# EAGLE design board_v1 (EAGLE 8.7.0)
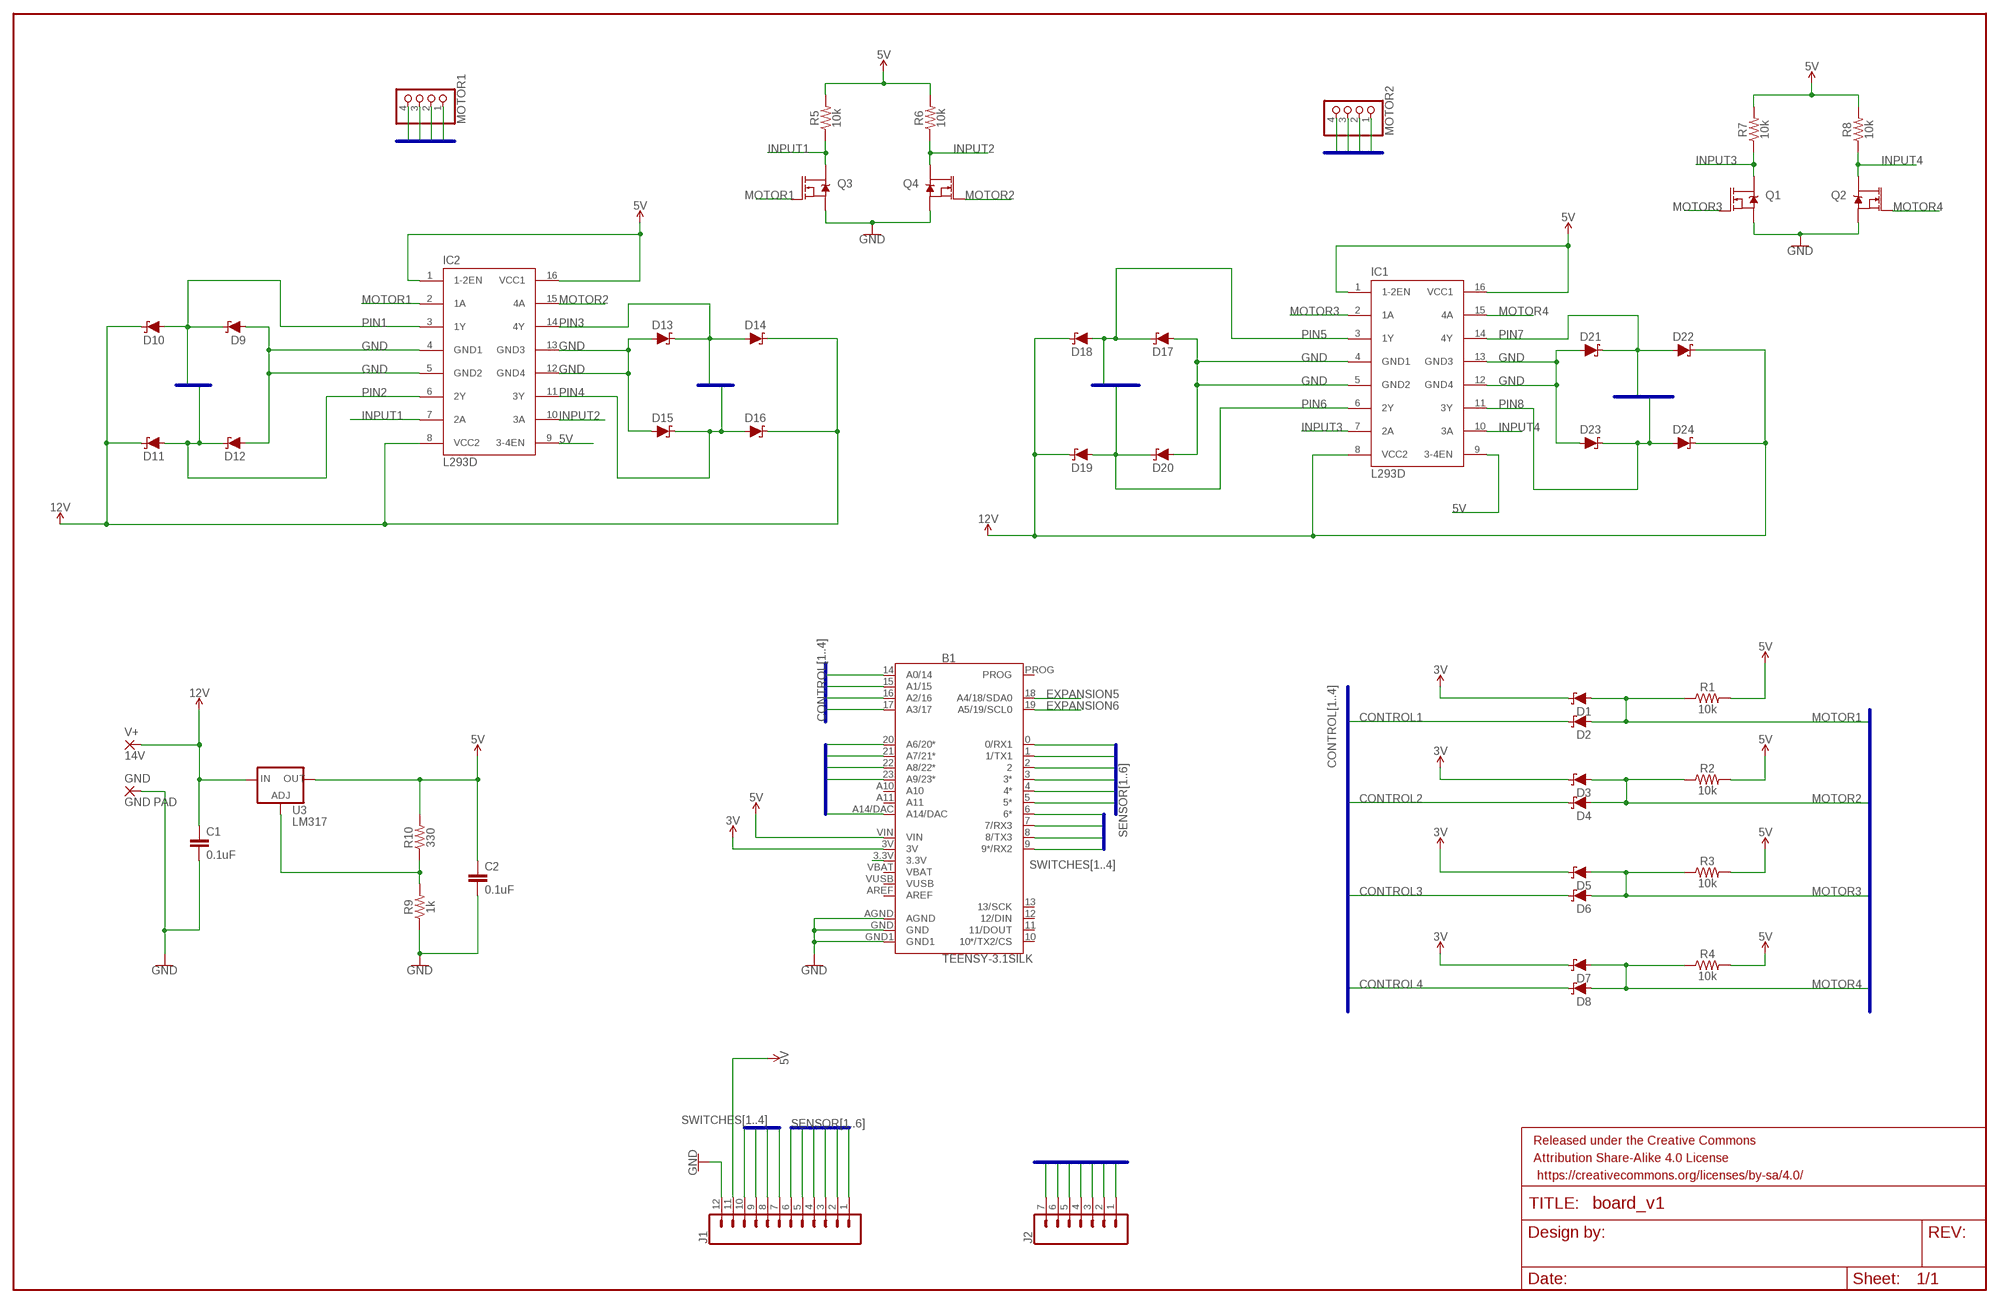
[diagram p0: schematic, sheet 1]

## Parts
B1  TEENSY-3.1SILK  [TEENSY-3.1]
C1  0.1uF  0.1UF-0603-25V-5%  [0603]
C2  0.1uF  0.1UF-0603-25V-5%  [0603]
D1  DIODE-SCHOTTKY-PMEG4005EJ  [SOD-323]
D2  DIODE-SCHOTTKY-PMEG4005EJ  [SOD-323]
D3  DIODE-SCHOTTKY-PMEG4005EJ  [SOD-323]
D4  DIODE-SCHOTTKY-PMEG4005EJ  [SOD-323]
D5  DIODE-SCHOTTKY-PMEG4005EJ  [SOD-323]
D6  DIODE-SCHOTTKY-PMEG4005EJ  [SOD-323]
D7  DIODE-SCHOTTKY-PMEG4005EJ  [SOD-323]
D8  DIODE-SCHOTTKY-PMEG4005EJ  [SOD-323]
D9  DIODE-SCHOTTKY-PMEG4005EJ  [SOD-323]
D10  DIODE-SCHOTTKY-PMEG4005EJ  [SOD-323]
D11  DIODE-SCHOTTKY-PMEG4005EJ  [SOD-323]
D12  DIODE-SCHOTTKY-PMEG4005EJ  [SOD-323]
D13  DIODE-SCHOTTKY-PMEG4005EJ  [SOD-323]
D14  DIODE-SCHOTTKY-PMEG4005EJ  [SOD-323]
D15  DIODE-SCHOTTKY-PMEG4005EJ  [SOD-323]
D16  DIODE-SCHOTTKY-PMEG4005EJ  [SOD-323]
D17  DIODE-SCHOTTKY-PMEG4005EJ  [SOD-323]
D18  DIODE-SCHOTTKY-PMEG4005EJ  [SOD-323]
D19  DIODE-SCHOTTKY-PMEG4005EJ  [SOD-323]
D20  DIODE-SCHOTTKY-PMEG4005EJ  [SOD-323]
D21  DIODE-SCHOTTKY-PMEG4005EJ  [SOD-323]
D22  DIODE-SCHOTTKY-PMEG4005EJ  [SOD-323]
D23  DIODE-SCHOTTKY-PMEG4005EJ  [SOD-323]
D24  DIODE-SCHOTTKY-PMEG4005EJ  [SOD-323]
FRAME1  FRAME-LEDGER  [CREATIVE_COMMONS]
GND  GND PAD  WIREPADSMD2,54-5,08  [SMD2,54-5,08]
IC1  L293D  [DIL16]
IC2  L293D  [DIL16]
J1  CONN_12  [1X12]
J2  CONN_07LOCK  [1X07_LOCK]
MOTOR1  PINHD-1X4  [1X04]
MOTOR2  PINHD-1X4  [1X04]
Q1  MOSFET-NCH-2N7002PW  [SOT323]
Q2  MOSFET-NCH-2N7002PW  [SOT323]
Q3  MOSFET-NCH-2N7002PW  [SOT323]
Q4  MOSFET-NCH-2N7002PW  [SOT323]
R1  10k  10KOHM-0603-1/10W-1%  [0603]
R2  10k  10KOHM-0603-1/10W-1%  [0603]
R3  10k  10KOHM-0603-1/10W-1%  [0603]
R4  10k  10KOHM-0603-1/10W-1%  [0603]
R5  10k  10KOHM-0603-1/10W-1%  [0603]
R6  10k  10KOHM-0603-1/10W-1%  [0603]
R7  10k  10KOHM-0603-1/10W-1%  [0603]
R8  10k  10KOHM-0603-1/10W-1%  [0603]
R9  1k  1KOHM-0603-1/10W-1%  [0603]
R10  330  3.3KOHM-0603-1/10W-1%  [0603]
U3  LM317  V_REG_317SINK  [TO220-ADJ]
V+  14V  WIREPADSMD2,54-5,08  [SMD2,54-5,08]

## Nets
3.3V: B1.3V D1.C D3.C D5.C D7.C ; supply symbol labelled 3V
5V: B1.VIN C2.1 IC1.1(1-2EN) IC1.9(3-4EN) IC1.16(VCC1) IC2.1(1-2EN) IC2.9(3-4EN) IC2.16(VCC1) J1.11 R1.2 R2.2 R3.2 R4.2 R5.2 R6.2 R7.2 R8.2 R10.2 U3.OUT
12V: C1.1 D10.C D11.C D14.C D16.C D18.C D19.C D22.C D24.C IC1.8(VCC2) IC2.8(VCC2) U3.IN V+.1(P)
CONTROL1: B1.17(A3/17) D2.C
CONTROL2: B1.16(A2/16) D4.C
CONTROL3: B1.15(A1/15) D6.C
CONTROL4: B1.14(A0/14) D8.C
EXPANSION1: B1.20(A6/20*) J2.1
EXPANSION2: B1.21(A7/21*) J2.2
EXPANSION3: B1.22(A8/22*) J2.3
EXPANSION4: B1.23(A9/23*) J2.4
EXPANSION5: B1.18(A4/18/SDA0) J2.5
EXPANSION6: B1.19(A5/19/SCL0) J2.6
EXPANSION7: B1.A14/DAC J2.7
GND: B1.AGND B1.GND B1.GND1 C1.2 C2.2 D9.A D12.A D13.A D15.A D17.A D20.A D21.A D23.A GND.1(P) IC1.4(GND1) IC1.5(GND2) IC1.12(GND4) IC1.13(GND3) IC2.4(GND1) IC2.5(GND2) IC2.12(GND4) IC2.13(GND3) J1.12 Q1.2(S) Q2.2(S) Q3.2(S) Q4.2(S) R9.1
INPUT1: IC2.7(2A) Q3.3(D) R5.1
INPUT2: IC2.10(3A) Q4.3(D) R6.1
INPUT3: IC1.7(2A) Q1.3(D) R7.1
INPUT4: IC1.10(3A) Q2.3(D) R8.1
MOTOR1: D1.A D2.A IC2.2(1A) Q3.1(G) R1.1
MOTOR2: D3.A D4.A IC2.15(4A) Q4.1(G) R2.1
MOTOR3: D5.A D6.A IC1.2(1A) Q1.1(G) R3.1
MOTOR4: D7.A D8.A IC1.15(4A) Q2.1(G) R4.1
N$1: B1.3.3V
N$6: R9.2 R10.1 U3.ADJ
PIN1: D9.C D10.A IC2.3(1Y) MOTOR1.4
PIN2: D11.A D12.C IC2.6(2Y) MOTOR1.3
PIN3: D13.C D14.A IC2.14(4Y) MOTOR1.2
PIN4: D15.C D16.A IC2.11(3Y) MOTOR1.1
PIN5: D17.C D18.A IC1.3(1Y) MOTOR2.4
PIN6: D19.A D20.C IC1.6(2Y) MOTOR2.3
PIN7: D21.C D22.A IC1.14(4Y) MOTOR2.2
PIN8: D23.C D24.A IC1.11(3Y) MOTOR2.1
SENSOR1: B1.0(0/RX1) J1.1
SENSOR2: B1.1(1/TX1) J1.2
SENSOR3: B1.2 J1.3
SENSOR4: B1.3(3*) J1.4
SENSOR5: B1.4(4*) J1.5
SENSOR6: B1.5(5*) J1.6
SWITCHES1: B1.6(6*) J1.7
SWITCHES2: B1.7(7/RX3) J1.8
SWITCHES3: B1.8(8/TX3) J1.9
SWITCHES4: B1.9(9*/RX2) J1.10
Unconnected: B1.10(10*/TX2/CS) B1.11(11/DOUT) B1.12(12/DIN) B1.13(13/SCK) B1.A10 B1.A11 B1.AREF B1.PROG

## Buses
CONTROL[1..4]
SENSOR[1..6]
MOTOR[1..4]
SWITCHES[1..4]
PIN[1..2]
PIN[1..4]
PIN[3..4]
PIN[5..8]
PIN[5..6]
PIN[7..8]
EXPANSION[1..7]

## Power pins joined to a net without a drawn wire
VBAT: B1.VBAT
VUSB: B1.VUSB

## Library data of the parts
B1 = SparkFun-Boards:TEENSY-3.1: Teensy 3+ Footprint Mechanical footprint with connectors for Teensy Development Board with ARM Cortex. SparkFun Products: Teensy 3.2 <https://www.sparkfun.com/products/13736> Teensy LC <https://www.sparkfun.com/products/13305>; SF_ID: DEV-12646
C1 C2 = SparkFun-Capacitors:0.1UF: 0.1µF ceramic capacitors A capacitor is a passive two-terminal electrical component used to store electrical energy temporarily in an electric field.; PROD_ID: CAP-08604
D1-D24 = SparkFun-DiscreteSemi:DIODE-SCHOTTKY: Schottky diode A Schottky diode is a semiconductor diode which has a low forward voltage drop and a very fast switching action.; PROD_ID: DIO-10955; VALUE: 0.5A/40V/420mV
FRAME1 = SparkFun-Aesthetics:FRAME-LEDGER: Schematic Frame - Ledger Standard 11x14 US Ledger frame
GND V+ = wirepad:WIREPAD: Wire PAD connect wire on PCB
IC1 IC2 = st-microelectronics:L293D: PUSH-PULL 4 CHANNEL DRIVER; MPN: L293D; OC_FARNELL: 9589619; OC_NEWARK: 56P8249
J1 = SparkFun-Connectors:CONN_12: Multi connection point. Often used as Generic Header-pin footprint for 0.1 inch spaced/style header connections On any of the 0.1 inch spaced packages, you can populate with these: Break Away Headers - Straight <https://www.sparkfun.com/products/116> (PRT-00116) Break Away Male Headers - Right Angle <https://www.sparkfun.com/products/553> (PRT-00553) Female Headers <https://www.sparkfun.com/products/115> (PRT-00115) Break Away Headers - Machine Pin <https://www.sparkfun.com/products/117> (PRT-00117) Break Away Female Headers - Swiss Machine Pin <https://www.sparkfun.com/products/743> (PRT-00743) For SCREWTERMINALS and SPRING TERMINALS visit here: Screw Terimnals on SparkFun.com <https://www.sparkfun.com/search/results?term=Screw+Terminals> (5mm/3.5mm/2.54mm spacing) This device is also useful as a general connection point to wire up your design to another part of your project. Our various solder wires solder well into these plated through hole pads. Hook-Up Wire - Assortment (Stranded, 22 AWG) <https://www.sparkfun.com/products/11375> (PRT-11375) Hook-Up Wire - Assortment (Solid Core, 22 AWG) <https://www.sparkfun.com/products/11367> (PRT-11367) View the entire wire category on our website here <https://www.sparkfun.com/categories/141> Special notes: Molex polarized connector foot print use with SKU : PRT-08231 with associated crimp pins and housings. 1MM SMD Version SKU: PRT-10208 NOTES ON THE VARIANTS LOCK and LOCK_LONGPADS... This footprint was designed to help hold the alignment of a through-hole component (i.e. 6-pin header) while soldering it into place. You may notice that each hole has been shifted either up or down by 0.005 of an inch from it's more standard position (which is a perfectly straight line). This slight alteration caused the pins (the squares in the middle) to touch the edges of the holes. Because they are alternating, it causes a "brace" to hold the component in place. 0.005 has proven to be the perfect amount of "off-center" position when using our standard breakaway headers. Although looks a little odd when you look at the bare footprint, once you have a header in there, the alteration is very hard to notice. Also,if you push a header all the way into place, it is covered up entirely on the bottom side.
J2 = SparkFun-Connectors:CONN_07: Multi connection point. Often used as Generic Header-pin footprint for 0.1 inch spaced/style header connections On any of the 0.1 inch spaced packages, you can populate with these: Break Away Headers - Straight <https://www.sparkfun.com/products/116> (PRT-00116) Break Away Male Headers - Right Angle <https://www.sparkfun.com/products/553> (PRT-00553) Female Headers <https://www.sparkfun.com/products/115> (PRT-00115) Break Away Headers - Machine Pin <https://www.sparkfun.com/products/117> (PRT-00117) Break Away Female Headers - Swiss Machine Pin <https://www.sparkfun.com/products/743> (PRT-00743) For SCREWTERMINALS and SPRING TERMINALS visit here: Screw Terimnals on SparkFun.com <https://www.sparkfun.com/search/results?term=Screw+Terminals> (5mm/3.5mm/2.54mm spacing) This device is also useful as a general connection point to wire up your design to another part of your project. Our various solder wires solder well into these plated through hole pads. Hook-Up Wire - Assortment (Stranded, 22 AWG) <https://www.sparkfun.com/products/11375> (PRT-11375) Hook-Up Wire - Assortment (Solid Core, 22 AWG) <https://www.sparkfun.com/products/11367> (PRT-11367) View the entire wire category on our website here <https://www.sparkfun.com/categories/141> Special notes: Molex polarized connector foot print use with SKU : PRT-08231 with associated crimp pins and housings. 1MM SMD Version SKU: PRT-10208 NOTES ON THE VARIANTS LOCK and LOCK_LONGPADS... This footprint was designed to help hold the alignment of a through-hole component (i.e. 6-pin header) while soldering it into place. You may notice that each hole has been shifted either up or down by 0.005 of an inch from it's more standard position (which is a perfectly straight line). This slight alteration caused the pins (the squares in the middle) to touch the edges of the holes. Because they are alternating, it causes a "brace" to hold the component in place. 0.005 has proven to be the perfect amount of "off-center" position when using our standard breakaway headers. Although looks a little odd when you look at the bare footprint, once you have a header in there, the alteration is very hard to notice. Also,if you push a header all the way into place, it is covered up entirely on the bottom side.
MOTOR1 MOTOR2 = pinhead:PINHD-1X4: PIN HEADER
Q1-Q4 = SparkFun-DiscreteSemi:MOSFET-NCH: N-channel MOSFETs Voltage controlled devices that allow control of high current outputs. SparkFun Products: SparkFun OpenScale <https://www.sparkfun.com/products/13261> SparkFun Digital Sandbox <https://www.sparkfun.com/products/12651> SparkFun Monster Moto Shield <https://www.sparkfun.com/products/10182> SparkFun MOSFET Power Controller <https://www.sparkfun.com/products/11214>; PROD_ID: TRANS-11151; VALUE: 310mA/60V/1.6Ω
R1-R8 = SparkFun-Resistors:10KOHM: 10kΩ resistor A resistor is a passive two-terminal electrical component that implements electrical resistance as a circuit element. Resistors act to reduce current flow, and, at the same time, act to lower voltage levels within circuits. - Wikipedia; PROD_ID: RES-00824
R9 = SparkFun-Resistors:1KOHM: 1kΩ resistor A resistor is a passive two-terminal electrical component that implements electrical resistance as a circuit element. Resistors act to reduce current flow, and, at the same time, act to lower voltage levels within circuits. - Wikipedia; PROD_ID: RES-07856
R10 = SparkFun-Resistors:3.3KOHM: 3.3kΩ resistor A resistor is a passive two-terminal electrical component that implements electrical resistance as a circuit element. Resistors act to reduce current flow, and, at the same time, act to lower voltage levels within circuits. - Wikipedia; PROD_ID: RES-07851; VALUE: 3.3k
U3 = SparkFun-IC-Power:V_REG_317: Voltage Regulator Standard LM317 adjustable voltage regulator. AOI (Adjust Output Input). Google 'LM317 Calculator' for easy to use app to get the two resistor values needed. 240/720 for 5V output. 240/390 for 3.3V output. Spark Fun Electronics SKU : COM-00527

## Board
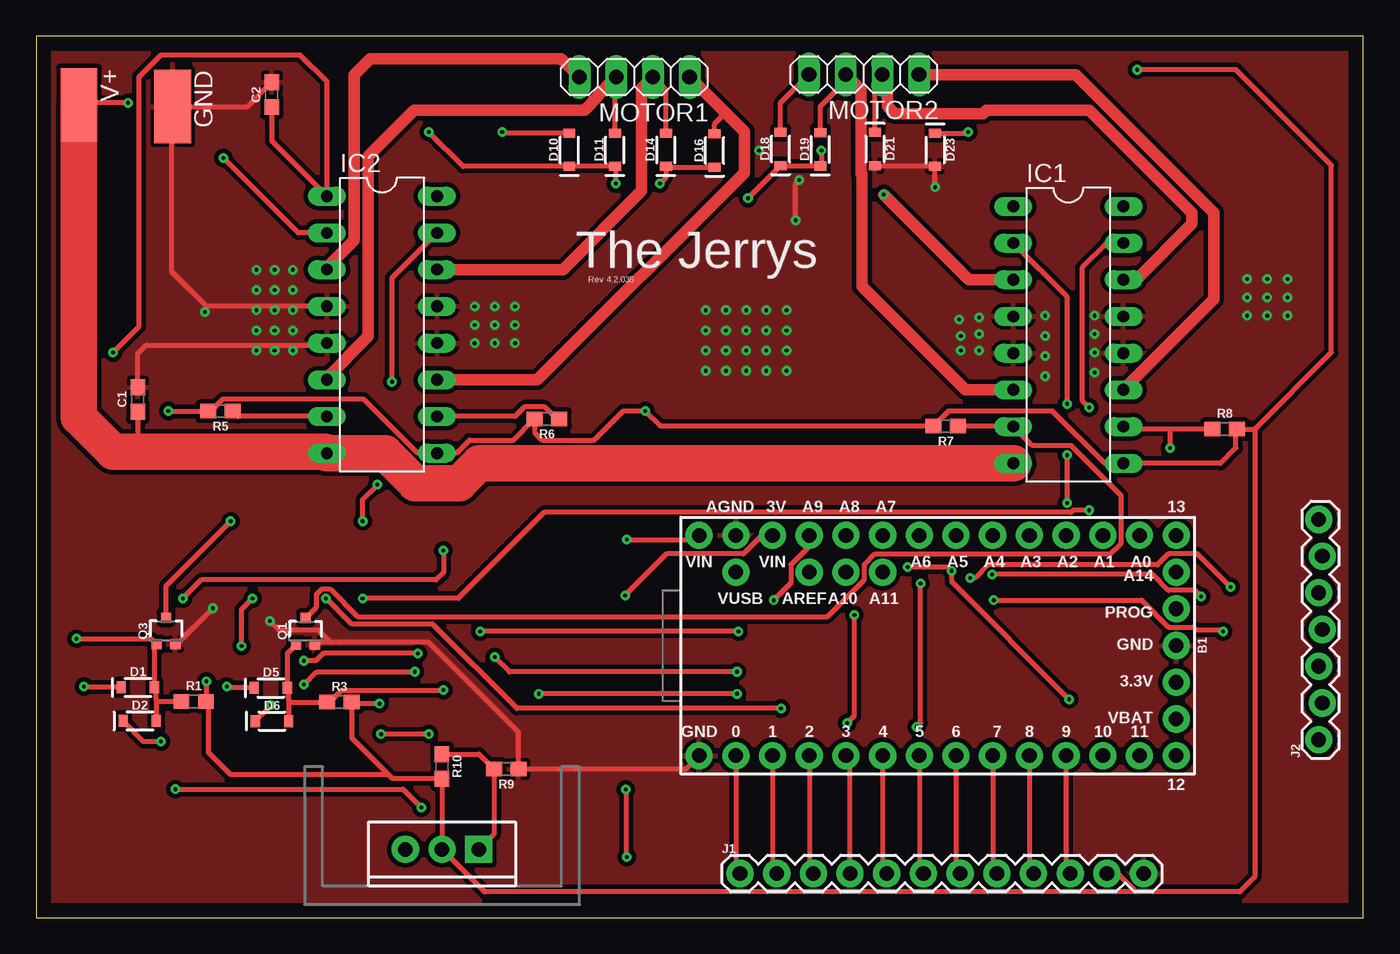
[diagram p1: board, top side]
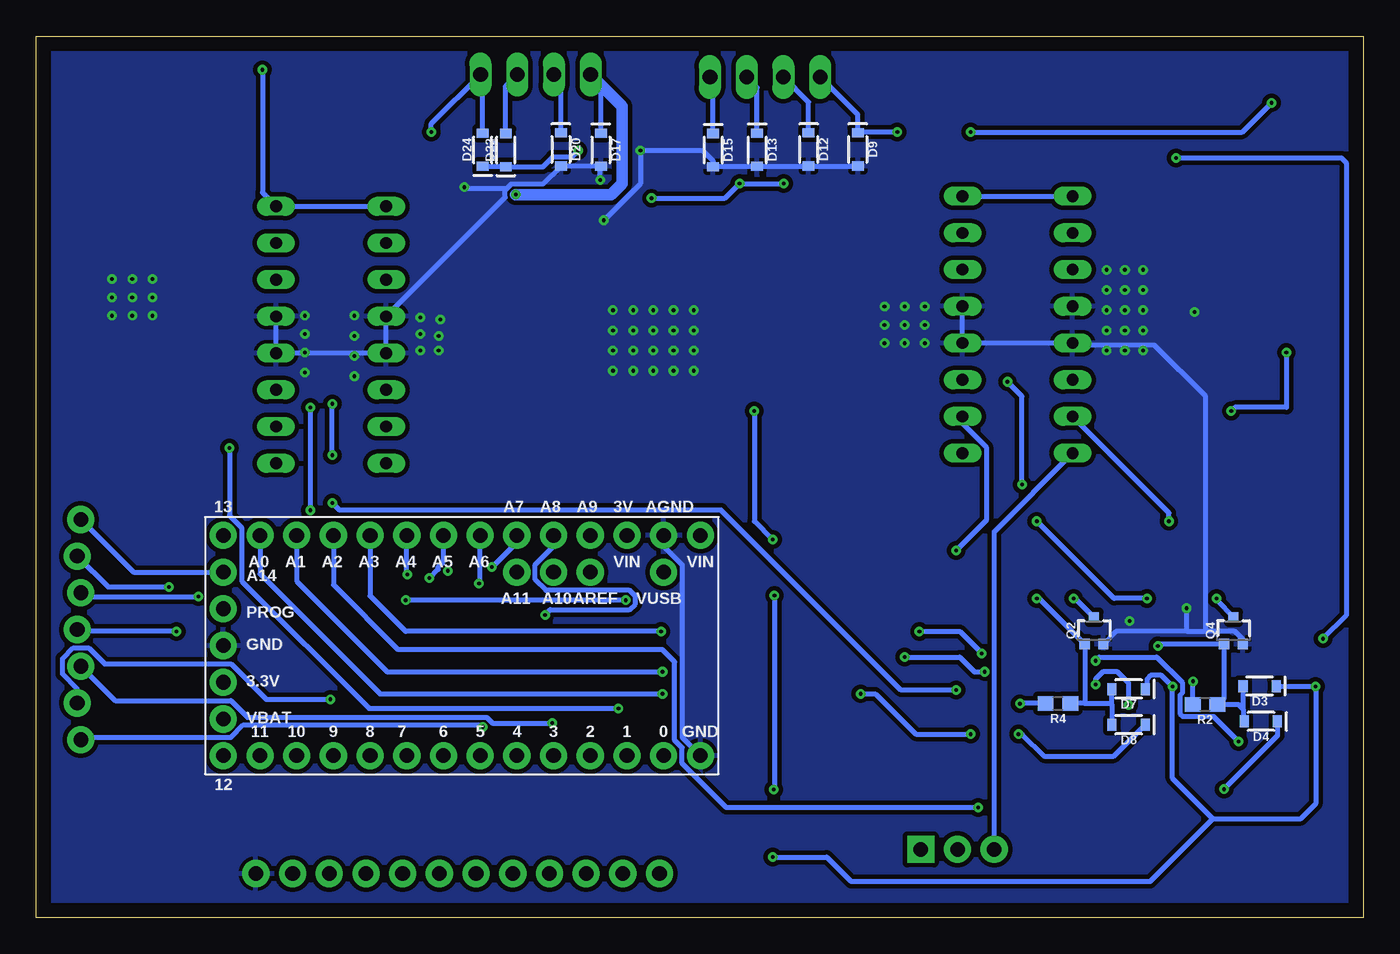
[diagram p2: board, bottom side, seen from below]

Size 91.87 x 61 mm. Coordinates in mm from the lower left corner, seen from the top.
Outline: 0,0 91.87,0 91.87,61 0,61 0,0
Copper layers (1*16): Top 0.035mm / dielectric 1.5mm / Bottom 0.035mm
Design rules "default *": minimum track width 6mil, minimum drill 10mil, track to track 6mil, track to pad 6mil, pad to pad 6mil, via to via 10mil, smd to smd 6mil, copper to edge 40mil, drill to drill 6mil, minimum pad ring 10mil, minimum via ring 8mil, stop-mask expansion 4mil, vias tented up to drill 0mil, thermal gap 10mil

### Footprints (pad centres in the part's own frame; a part is rotated, then mirrored left to right if it is on the bottom)
TEENSY-3.1 = drill 1.016 pad 1.88: 0 7.62,-13.97; 1 7.62,-11.43; 2 7.62,-8.89; 3 7.62,-6.35; 3.3V 2.54,16.51; 3V -7.62,-11.43; 4 7.62,-3.81; 5 7.62,-1.27; 6 7.62,1.27; 7 7.62,3.81; 8 7.62,6.35; 9 7.62,8.89; 10 7.62,11.43; 11 7.62,13.97; 12 7.62,16.51; 13 -7.62,16.51; 14 -7.62,13.97; 15 -7.62,11.43; 16 -7.62,8.89; 17 -7.62,6.35; 18 -7.62,3.81; 19 -7.62,1.27; 20 -7.62,-1.27; 21 -7.62,-3.81; 22 -7.62,-6.35; 23 -7.62,-8.89; A10 -5.08,-6.35; A11 -5.08,-3.81; A14/DAC -5.08,16.51; AGND -7.62,-13.97; AREF -5.08,-8.89; GND 0,16.51; GND1 7.62,-16.51; PROG -2.54,16.51; VBAT 5.08,16.51; VIN -7.62,-16.51; VUSB -5.08,-13.97
0603 = smd 1.1 x 1: 1 -0.85,0; 2 0.85,0
SOD-323 = smd 0.63 x 0.83: A 1.15,0; C -1.15,0
SMD2,54-5,08 = smd 2.54 x 5.08: 1 0,0
DIL16 = drill 0.813 long: 1 -8.89,-3.81; 2 -6.35,-3.81; 3 -3.81,-3.81; 4 -1.27,-3.81; 5 1.27,-3.81; 6 3.81,-3.81; 7 6.35,-3.81; 8 8.89,-3.81; 9 8.89,3.81; 10 6.35,3.81; 11 3.81,3.81; 12 1.27,3.81; 13 -1.27,3.81; 14 -3.81,3.81; 15 -6.35,3.81; 16 -8.89,3.81
1X12 = drill 1.016 pad 1.88: 1 0,0; 2 2.54,0; 3 5.08,0; 4 7.62,0; 5 10.16,0; 6 12.7,0; 7 15.24,0; 8 17.78,0; 9 20.32,0; 10 22.86,0; 11 25.4,0; 12 27.94,0
1X07_LOCK = drill 1.016 pad 1.88: 1 0,0.127; 2 2.54,-0.127; 3 5.08,0.127; 4 7.62,-0.127; 5 10.16,0.127; 6 12.7,-0.127; 7 15.24,0.127
1X04 = drill 1.016 long: 1 -3.81,0; 2 -1.27,0; 3 1.27,0; 4 3.81,0
SOT323 = smd 0.7 x 0.7: 1 -0.65,-0.925; 2 0.65,-0.925; 3 0,0.925
TO220-ADJ = drill 1 pad 1.88 square: ADJ -2.54,0 | drill 1 pad 1.88: IN 2.54,0; OUT 0,0

### Placement (x,y rotation side)
B1  62.4,18.83 270 top
C1  7.04,35.86 90 top
C2  16.31,56.95 90 top
D1  7.04,15.93 0 top
D2  7.17,13.62 0 top
D3  7.18,16.03 180 bottom
D4  7.1,13.58 180 bottom
D5  16.25,15.9 0 top
D6  16.33,13.6 0 top
D7  16.25,15.82 180 bottom
D8  16.25,13.35 180 bottom
D9  35,53.16 270 bottom
D10  36.91,53.14 90 top
D11  40.06,53.14 90 top
D12  38.4,53.16 270 bottom
D13  41.96,53.14 270 bottom
D14  43.59,53.14 90 top
D15  45.01,53.11 270 bottom
D16  46.96,53.09 90 top
D17  52.78,53.14 270 bottom
D18  51.54,53.19 90 top
D19  54.28,53.16 90 top
D20  55.55,53.16 270 bottom
D21  58.06,53.19 270 top
D22  59.36,53.11 90 bottom
D23  62.23,53.14 270 top
D24  60.96,53.14 90 bottom
FRAME1  -10,-15 0 top  (outside the outline)
GND  9.45,56.12 180 top
IC1  71.45,40.34 270 top
IC2  23.94,41.03 270 top
J1  48.72,3.06 0 top
J2  88.9,12.32 90 top
MOTOR1  41.42,58.17 180 top
MOTOR2  57.3,58.34 180 top
Q1  18.64,19.81 0 top
Q2  18.64,19.86 0 bottom
Q3  8.99,19.84 0 top
Q4  8.99,19.86 0 bottom
R1  10.91,14.96 0 top
R2  10.97,14.76 180 bottom
R3  20.99,14.91 0 top
R4  21.14,14.83 180 bottom
R5  12.75,35.05 180 top
R6  35.36,34.52 180 top
R7  62.97,34.01 180 top
R8  82.27,33.81 0 top
R9  32.54,10.29 180 top
R10  28.09,10.46 270 top
U3  28.1,4.73 180 top
V+  2.96,56.25 180 top

### Tracks (layer width: path | path; a pad name or v marks a point on that pad's centre or on a via)
3.3V  (via drill 0.25)
  Top 0.356: D1.C 3.37,15.93 v3.3,16 | D5.C 13.31,15.89 v13.21,16 | B1.3V 50.23,26.45 48.96,25.18 43.65,25.18 v40.77,22.3 | v40.82,8.87 40.82,4.27 v40.89,4.19
  Bottom 0.356: D3.C 6,16 v3.3,16 3.3,7.87 4.32,6.86 10.41,6.86 | 10.41,6.86 13.21,9.65 v13.21,16 13.97,16.76 14.73,16.76 14.99,16.51 14.99,15.94 D7.C | v40.77,22.3 40.77,8.91 v40.82,8.87 | v40.89,4.19 37.13,4.19 35.46,2.52 14.76,2.52 10.41,6.86
5V  (via drill 0.25)
  Top 0.356: C2.1 16.31,53.75 IC2.1 20.13,57.85 18.29,59.69 8.64,59.69 7.11,58.17 7.11,40.89 v5.33,39.12 | 84.35,33.81 R8.2 83.06,33.74 83.06,32.51 81.99,31.45 IC1.9 73.97,31.45 70.36,35.05 63.16,35.05 R7.2 43.2,34.01 v42.16,35.05 40.64,35.05 38.63,33.05 35.03,33.05 34.51,33.56 R6.2 33.03,33.05 29.99,33.05 29.09,32.14 IC2.9 26.41,32.14 22.67,35.88 12.91,35.88 12.08,35.05 R5.2 v9.14,35.05 | 84.35,33.81 89.66,39.12 89.66,52.07 83.06,58.67 v76.2,58.67 | J1.11 74.86,3.06 76.13,1.79 | 76.13,1.79 83.32,1.79 84.35,2.82 84.35,33.81 | 21.84,14.74 R3.2 | 21.84,14.74 21.84,12.45 24.38,9.91 | 24.38,9.91 24.64,9.65 28.05,9.65 R10.2 U3.OUT 31.04,1.79 76.13,1.79 | 24.38,9.91 13.46,9.91 11.94,11.43 11.94,14.78 R1.2 11.79,14.99 v11.79,16.36 | v40.89,26.16 45.6,26.16 B1.VIN | v23.77,14.81 21.91,14.81 21.84,14.74
  Bottom 0.356: IC2.16 IC2.1 | v76.2,58.67 76.2,50.16 IC1.16 IC1.1 | v42.16,35.05 42.16,27.43 v40.89,26.16 | v5.33,39.12 5.33,35.31 8.89,35.31 v9.14,35.05 | R2.2 11.82,16.32 v11.79,16.36 | R4.2 23.75,14.83 v23.77,14.81
12V  (via drill 0.25)
  Top 0.356: D16.C 43.64,51.94 D14.C 43.59,51.21 v43.18,50.8 | v40.13,50.8 40.13,51.91 D11.C D10.C 29.55,51.99 v27.18,54.36 | C1.1 7.04,32.34 7.12,32.26 | v49.28,49.78 D18.C 51.56,52.01 D19.C 54.36,52.09 v54.36,53.09 | v6.35,56.39 3.1,56.39 V+.1
  Top 2.54: V+.1 2.96,34.63 5.33,32.26 7.12,32.26 20.01,32.26 IC2.8 24.14,32.14 26.23,30.06 29.27,30.06 30.66,31.45 IC1.8
  Bottom 0.356: v40.13,50.8 v43.18,50.8 44.2,49.78 v49.28,49.78 | U3.IN 25.56,26.72 IC2.8 | v27.18,54.36 8.38,54.36 v6.35,56.39 | D24.C 59.38,51.99 D22.C 56.8,51.96 56.1,52.66 54.78,52.66 v54.36,53.09
CONTROL1  (via drill 0.25)
  Top 0.356: v48.62,19.81 v30.73,19.81 | v26.42,18.29 19.86,18.29 19.35,17.78 v18.54,17.78 | v8.64,12.19 7.45,12.19 D2.C
  Bottom 0.356: B1.17 68.75,22.27 66.29,19.81 v48.62,19.81 48.51,19.81 | v30.73,19.81 27.94,19.81 v26.42,18.29 | v8.64,12.19 10.37,13.93 12.51,13.93 12.7,14.12 12.7,15.39 12.55,15.54 12.55,16.28 14.31,18.03 18.29,18.03 v18.54,17.78
CONTROL2  (via drill 0.25)
  Top 0.356: v9.65,8.89 25.4,8.89 v26.67,7.62
  Bottom 0.356: B1.16 71.29,23.03 66.8,18.54 48.51,18.54 47.67,17.7 47.67,12.27 47.16,11.77 47.16,10.69 44.1,7.62 v26.67,7.62 | D4.C 5.95,12.6 v9.65,8.89
CONTROL3  (via drill 0.25)
  Top 0.356: v48.51,17.02 32.77,17.02 v31.75,18.03 | v16.26,14.73 16.26,14.68 D6.C | v18.54,16.13 19.43,17.02 v26.22,17.02
  Bottom 0.356: B1.15 73.83,23.29 67.56,17.02 v48.51,17.02 | v31.75,18.03 27.94,18.03 26.92,17.02 v26.22,17.02 | v16.26,14.73 16.26,16.26 17.02,17.02 18.03,17.02 18.54,16.51 v18.54,16.13
CONTROL4  (via drill 0.25)
  Top 0.356: v48.51,15.49 v34.8,15.49 | v27.18,12.7 v23.88,12.7
  Bottom 0.356: B1.14 76.37,23.8 68.07,15.49 v48.51,15.49 | v34.8,15.49 33.78,15.49 30.99,12.7 v27.18,12.7 | v23.88,12.7 23.62,12.7 22.1,11.18 17.27,11.18 D8.C
EXPANSION1  (via drill 0.25)
  Top 0.356: v60.96,13.21 61.21,13.46 v61.21,23.11
  Bottom 0.356: J2.1 88.61,12.48 78.39,12.48 77.54,13.34 61.21,13.34 61.09,13.21 v60.96,13.21 | v61.21,23.11 61.13,23.19 B1.20
EXPANSION2  (via drill 0.25)
  Top 0.356: v71.5,15.11 63.37,23.24 v63.37,24 63.12,24.26 v60.33,24.26
  Bottom 0.356: J2.2 89.03,15.86 90.04,16.87 90.04,17.93 89.3,18.67 88.25,18.67 87.14,17.56 78.39,17.56 75.94,15.11 v71.5,15.11 | v60.33,24.26 58.59,25.99 B1.21
EXPANSION3  (via drill 0.25)
  Top 0.356: v56.13,13.46 56.64,13.97 v56.64,20.95
  Bottom 0.356: v56.13,13.46 60.28,13.46 60.69,13.87 77.23,13.87 78.39,15.02 86.4,15.02 J2.3 | B1.22 56.05,25.71 57.32,24.44 57.32,23.39 56.58,22.64 50.79,22.64 50.39,22.25 50.39,21.7 50.78,21.31 56.29,21.31 v56.64,20.95
EXPANSION4  (via drill 0.25)
  Top 0.356: B1.23 53.51,25.71 52.24,24.44 52.24,23.16 v51.05,21.97 | v66.29,21.97 76.52,21.97 78.39,20.1 80.1,20.1 80.26,19.94 82.04,19.94 v82.17,19.81
  Bottom 0.356: v51.05,21.97 v66.29,21.97 | v82.17,19.81 88.9,19.81 J2.4
EXPANSION5  (via drill 0.25)
  Top 0.356: v80.64,22.23 80.23,22.64 78.39,22.64 77.28,23.75 v66.17,23.75
  Bottom 0.356: J2.5 88.52,22.23 v80.64,22.23 | v66.17,23.75 66.21,23.8 B1.18
EXPANSION6  (via drill 0.25)
  Top 0.356: v64.64,23.5 64.98,23.5 65.89,24.41 77.61,24.41 78.39,25.18 80.38,25.18 v82.68,22.89
  Bottom 0.356: J2.6 86.89,22.89 v82.68,22.89 | v64.64,23.5 64.03,24.11 64.03,24.28 63.67,24.64 B1.19
EXPANSION7
  Bottom 0.356: J2.7 85.13,23.91 B1.A14/DAC
GND  (via drill 0.25)
  Top 0.356: D21.A 58.12,51.99 D23.A v62.23,50.55 | C1.2 7.04,39.04 7.62,39.62 19.99,39.62 IC2.5 | C2.2 14.63,56.12 GND.1 9.4,56.07 9.4,44.7 11.8,42.3 IC2.4 | B1.GND1 44.97,10.29 R9.1 33.39,12.84 27.18,19.05 19.46,19.05 Q1.2 | v52.58,48.26 52.58,50.8 v52.83,51.05 | Q3.2 9.74,18.91 v12.24,21.41 | 21.08,19.05 20.4,19.05 19.56,19.89 16.82,19.89 v16.18,20.52
  Bottom 0.356: D9.A D12.A 38.43,51.99 D13.A 44.98,51.99 D15.A 45.01,52.38 45.72,53.09 v50.04,53.09 50.04,50.8 v52.58,48.26 | IC1.13 IC1.12 IC1.5 IC1.4 59.41,49.84 59.41,50.34 59.32,50.43 | IC2.13 IC2.12 IC2.5 19.99,39.62 14.48,39.62 10.92,36.07 10.92,19.81 | Q4.2 8.34,19.26 8.89,19.81 10.92,19.81 | 12.16,19.81 10.92,19.81 | 12.16,19.81 17.12,19.81 Q2.2 | B1.AGND 48.43,25.71 47.16,24.44 47.16,12.48 B1.GND1 | 59.32,50.43 58.98,50.77 56.79,50.77 D20.A 55.52,51.99 D17.A 52.83,51.94 v52.83,51.05 | 59.32,50.43 62.12,50.43 v62.23,50.55 | v12.24,21.41 12.24,19.89 12.16,19.81
  other vias: 11.68,41.91 17.78,44.83 17.78,43.43 17.78,42.04 17.78,40.64 17.78,39.24 16.51,39.24 16.51,40.64 16.51,42.04 16.51,43.43 16.51,44.83 15.24,44.83 15.24,43.43 15.24,42.04 15.24,40.64 15.24,39.24 30.35,42.29 30.35,41.02 30.35,39.75 31.75,39.75 31.75,41.02 31.75,42.29 33.15,39.75 33.15,41.02 33.15,42.29 46.35,42.04 47.75,42.04 49.15,42.04 50.55,42.04 51.94,42.04 51.94,40.64 50.55,40.64 49.15,40.64 47.75,40.64 46.35,40.64 46.35,39.24 47.75,39.24 49.15,39.24 50.55,39.24 51.94,39.24 46.35,37.85 47.75,37.85 49.15,37.85 50.55,37.85 51.94,37.85 65.28,41.53 65.28,40.39 65.28,39.24 64.01,39.24 64.01,40.26 63.88,41.4 69.85,41.66 69.85,40.26 69.85,38.86 69.85,37.47 73.28,41.66 73.28,40.39 73.28,39.12 73.28,37.72 83.82,44.2 85.22,44.2 86.61,44.2 86.61,42.93 85.22,42.93 83.82,42.93 86.61,41.66 85.22,41.66 83.82,41.66
  pour Bottom (isolate 0.305): 0,61.01 91.87,61.01 91.87,0.03 0,0.03
  pour Top (isolate 0.305): -0.1,60.99 91.87,60.99 91.87,0.03 -0.1,0.03
INPUT1  (via drill 0.25)
  Top 0.356: IC2.7 13.97,34.68 R5.1 | Q3.3 8.99,22.96 v13.46,27.43
  Bottom 0.356: v13.46,27.43 13.46,28.02 IC2.7
INPUT2  (via drill 0.25)
  Top 0.356: R6.1 36.02,34.52 35.19,35.35 33.82,35.35 33.16,34.68 IC2.10 | v28.19,25.4 28.19,23.88 27.69,23.37 11.43,23.37 v10.16,22.1
  Bottom 0.356: IC2.10 27.75,34.2 26.1,32.55 26.1,27.5 v28.19,25.4 | v10.16,22.1 10.16,21.96 Q4.3
INPUT3
  Top 0.356: R7.1 67.61,34.01 IC1.7 68.96,32.66 71.65,32.66 75.1,29.21 75.1,25.93 74.36,25.18 58.07,25.18 57.32,24.44 57.32,23.39 54.77,20.83 22.27,20.83 20.34,22.76 19.79,22.76 19.41,22.37 19.41,21.5 Q1.3
INPUT4  (via drill 0.25)
  Top 0.356: R8.1 78.49,33.81 | 78.49,33.81 75.44,33.81 IC1.10 | 78.49,33.81 v78.49,32.51 | v51.56,14.48 33.27,14.48 27.43,20.32 21.84,20.32 v20.07,22.1
  Bottom 0.356: v78.49,32.51 78.49,27.82 77.64,26.98 77.64,23.29 68.83,14.48 v51.56,14.48 | v20.07,22.1 19.95,22.1 Q2.3
MOTOR1  (via drill 0.25)
  Top 0.356: 8.32,15.06 D2.A | 8.32,15.06 8.32,15.8 D1.A 8.19,18.76 Q3.1 7.95,19.3 v2.79,19.3 | R1.1 8.43,14.96 8.32,15.06 | IC2.2 18.15,47.38 v12.95,52.58
  Bottom 0.356: v12.95,52.58 1.52,52.58 1.19,52.25 1.19,20.9 v2.79,19.3
MOTOR2  (via drill 0.25)
  Top 0.356: v14.22,18.8 14.22,21.34 v14.99,22.1 | v22.61,27.43 22.61,28.96 v23.62,29.97 | v24.64,37.08 24.64,44.27 IC2.15
  Bottom 0.356: 8.33,14.43 D3.A | 8.33,14.43 8.33,13.66 D4.A | 10.05,14.76 R2.1 | 10.05,14.76 8.66,14.76 8.33,14.43 | 10.05,14.76 9.64,15.16 Q4.1 14.08,18.94 v14.22,18.8 | v14.99,22.1 17.27,22.1 v22.61,27.43 | v23.62,29.97 23.62,36.07 v24.64,37.08
MOTOR3  (via drill 0.25)
  Top 0.356: 17.48,15.06 D6.A | 17.48,15.06 17.48,15.82 D5.A 17.4,18.29 Q1.1 | 17.48,15.06 17.62,14.91 R3.1 20.32,14.91 21.15,15.74 v28.19,15.74 v28.19,15.75 | v71.37,28.7 v71.37,32 | v71.37,35.56 71.37,42.95 IC1.2
  Bottom 0.356: v28.19,15.75 32,15.75 44.45,28.19 70.87,28.19 v71.37,28.7 | v71.37,32 v71.37,35.56
MOTOR4  (via drill 0.25)
  Top 0.356: IC1.15 74.12,46.69 72.39,44.96 72.39,35.81 v72.9,35.31 | v72.9,28.19 71.8,28.19 71.65,28.04 35.15,28.04 29.21,22.1 v22.61,22.1
  Bottom 0.356: 17.4,14.72 D8.A | 17.4,14.72 D7.A | 19.29,14.83 R4.1 | 19.29,14.83 17.51,14.83 17.4,14.72 | 19.29,14.83 Q2.1 22.45,22.1 v22.61,22.1 | v72.9,35.31 v72.9,28.19
N$6
  Top 0.356: U3.ADJ 31.69,5.78 R9.2 30.66,11.31 R10.1
PIN1  (via drill 0.25)
  Top 0.356: D10.A 32.33,54.29 v32.26,54.36
  Top 0.813: IC2.3 20.13,45 22.01,46.88 22.01,58.33 23.11,59.44 36.34,59.44 MOTOR1.4
  Bottom 0.356: MOTOR1.4 35,55.56 D9.C 34.96,54.36 v32.26,54.36
PIN2
  Top 0.356: D11.A 40.06,57.86 39.95,57.97
  Top 0.813: IC2.6 20.13,37.38 22.97,40.22 22.97,52.69 26.16,55.88 37.95,55.88 38.93,56.86 38.93,56.95 39.95,57.97 MOTOR1.3
  Bottom 0.356: D12.C 38.41,56.43 MOTOR1.3
PIN3
  Top 0.356: D14.A 43.59,57.27 MOTOR1.2
  Top 0.813: IC2.14 36.46,44.84 41.91,50.29 41.91,57.39 MOTOR1.2
  Bottom 0.356: D13.C 41.96,57.45 MOTOR1.2
PIN4
  Top 0.356: D16.A 46.97,54.93 47.72,55.68
  Top 0.813: IC2.11 34.68,37.22 49.02,51.56 49.02,54.38 47.72,55.68 MOTOR1.1
  Bottom 0.356: D15.C 45.01,57.95 MOTOR1.1
PIN5  (via drill 0.25)
  Top 0.356: D18.A 51.54,56.39 MOTOR2.4
  Top 0.813: IC1.3 64.57,44.15 v58.67,50.04
  Bottom 0.356: D17.C 52.78,57.63 MOTOR2.4
  Bottom 0.813: v58.67,50.04 52.07,50.04 51.31,50.8 51.31,56.16 MOTOR2.4
PIN6
  Top 0.356: D19.A 54.28,56.15 56.25,58.12
  Top 0.813: IC1.6 64.31,36.52 57.15,43.69 57.15,51.43 57.09,51.49 57.09,57.29 56.25,58.12 MOTOR2.3
  Bottom 0.356: D20.C 55.55,57.86 MOTOR2.3
PIN7
  Top 0.356: D21.C 58.06,57.84 MOTOR2.2
  Top 0.813: MOTOR2.2 58.93,57.99 58.93,56.13 59.44,55.63 65.53,55.63 65.79,55.88 72.9,55.88 80.01,48.77 80.01,48.01 76.15,44.15 IC1.14
  Bottom 0.356: D22.A 59.36,57.56 MOTOR2.2
PIN8  (via drill 0.25)
  Top 0.356: D23.C 64.45,54.29 v64.52,54.36
  Top 0.813: MOTOR2.1 71.96,58.34 81.53,48.77 81.53,42.8 IC1.11
  Bottom 0.356: v64.52,54.36 64.52,54.94 MOTOR2.1 60.96,58.19 D24.A
SENSOR1
  Top 0.356: B1.0 48.43,3.34 J1.1
SENSOR2
  Top 0.356: B1.1 50.97,3.34 J1.2
SENSOR3
  Top 0.356: B1.2 53.51,3.34 J1.3
SENSOR4
  Top 0.356: J1.4 56.34,10.93 B1.3
SENSOR5
  Top 0.356: B1.4 58.59,3.34 J1.5
SENSOR6
  Top 0.356: B1.5 61.13,3.34 J1.6
SWITCHES1
  Top 0.356: B1.6 63.67,3.34 J1.7
SWITCHES2
  Top 0.356: B1.7 66.21,3.34 J1.8
SWITCHES3
  Top 0.356: B1.8 68.75,3.34 J1.9
SWITCHES4
  Top 0.356: B1.9 71.29,3.34 J1.10

### Text on the board
tNames: Rev 4.2.035 | The Jerrys